# EAGLE board sonar_preprocessor (EAGLE 8.3.2)
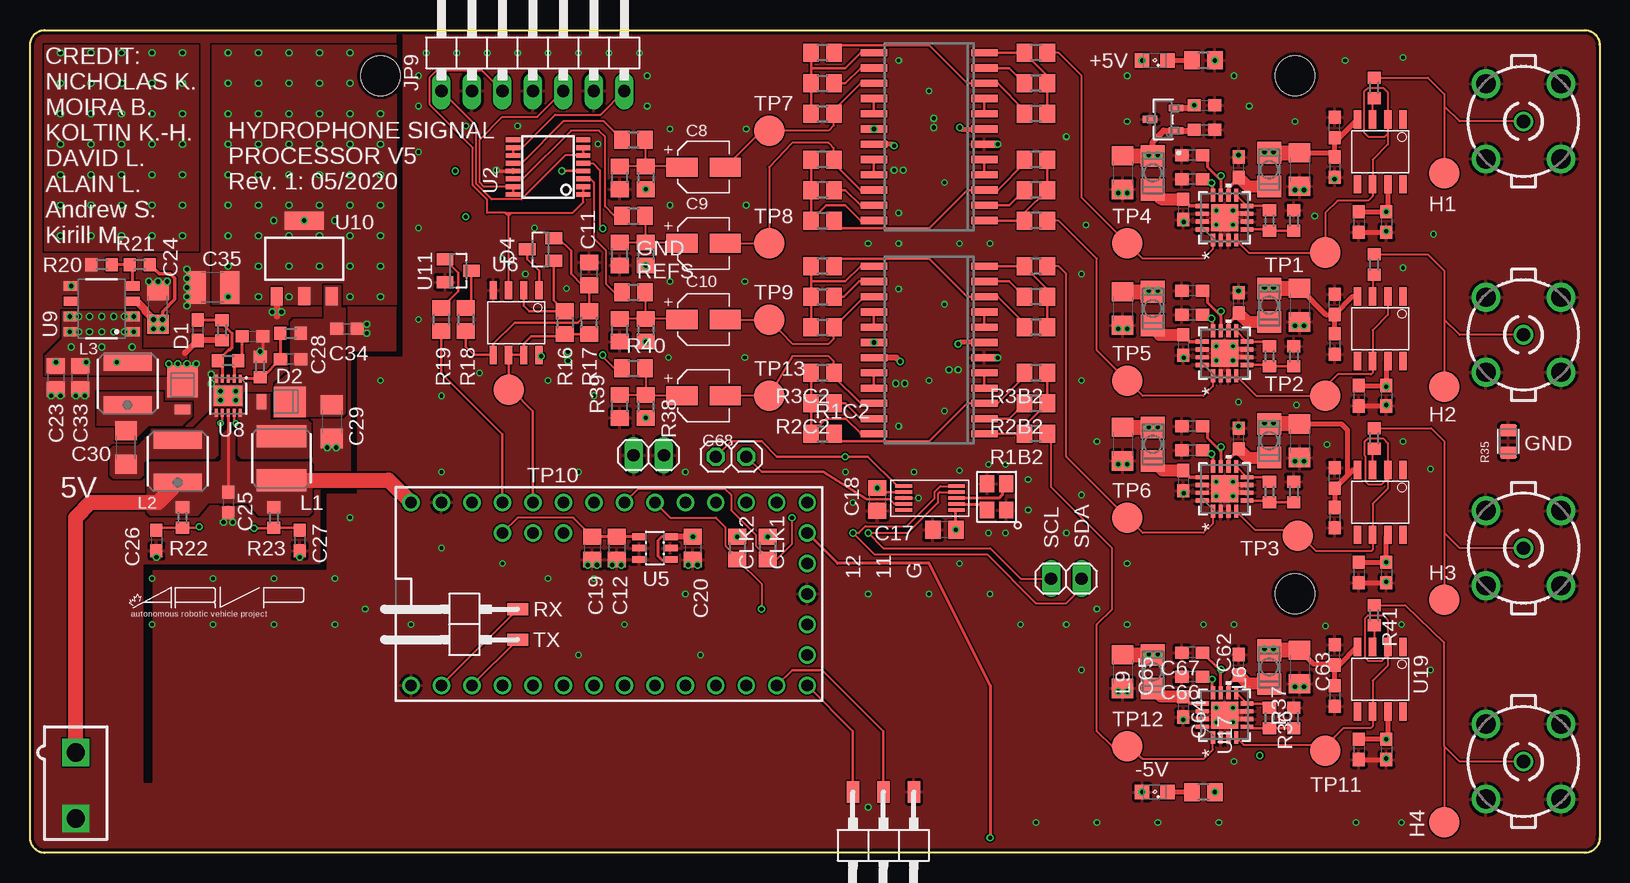
[diagram p7: board, top side]
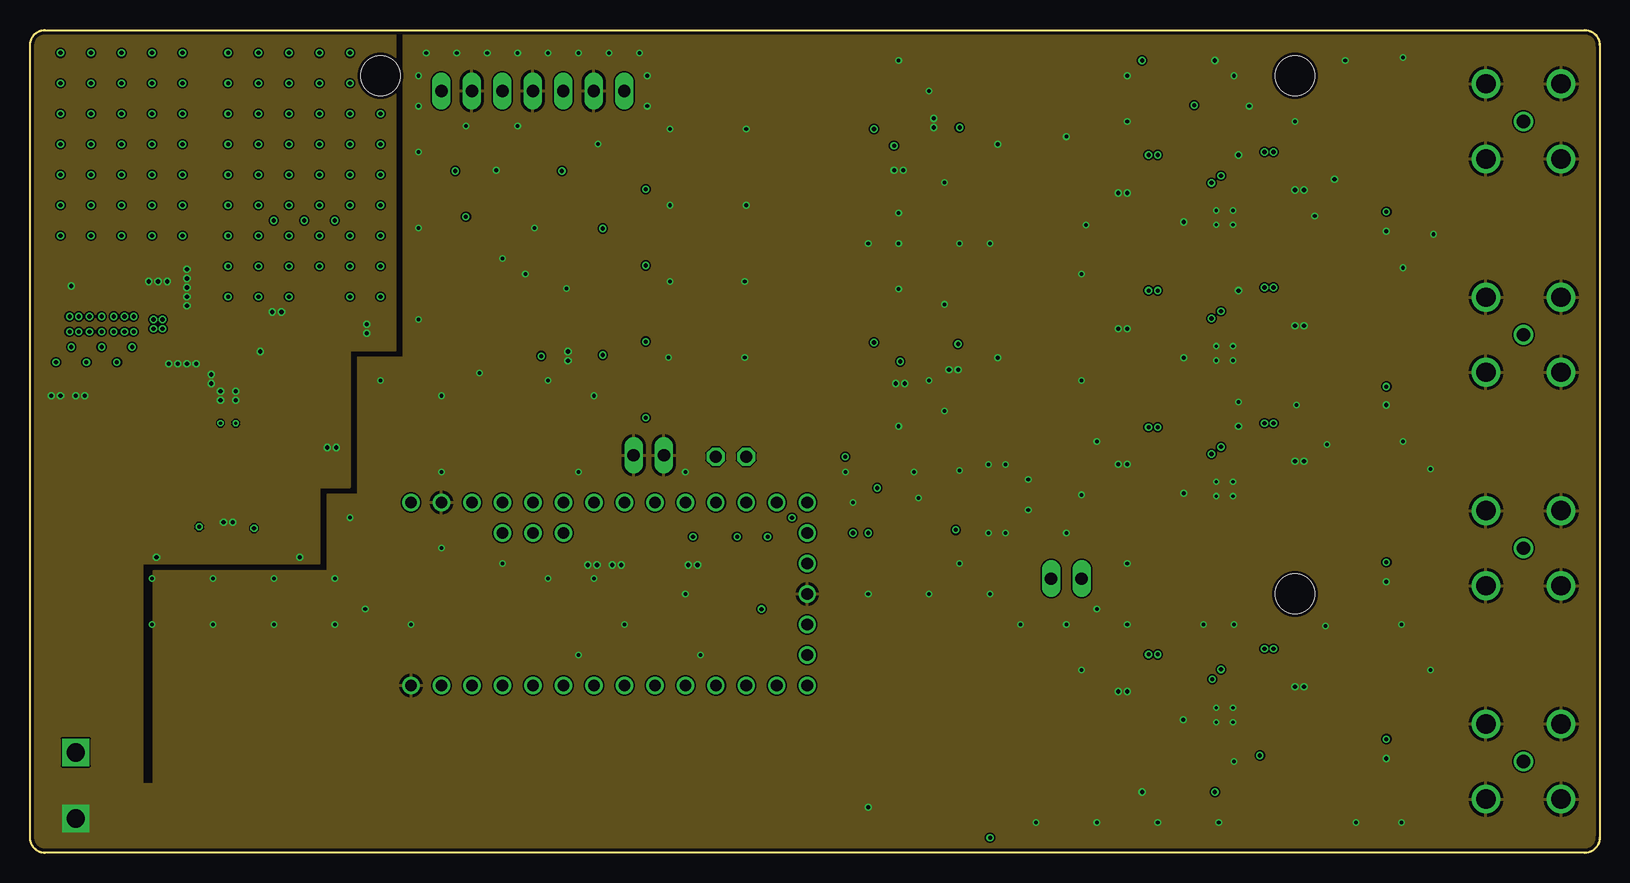
[diagram p8: board, inner layer Route2]
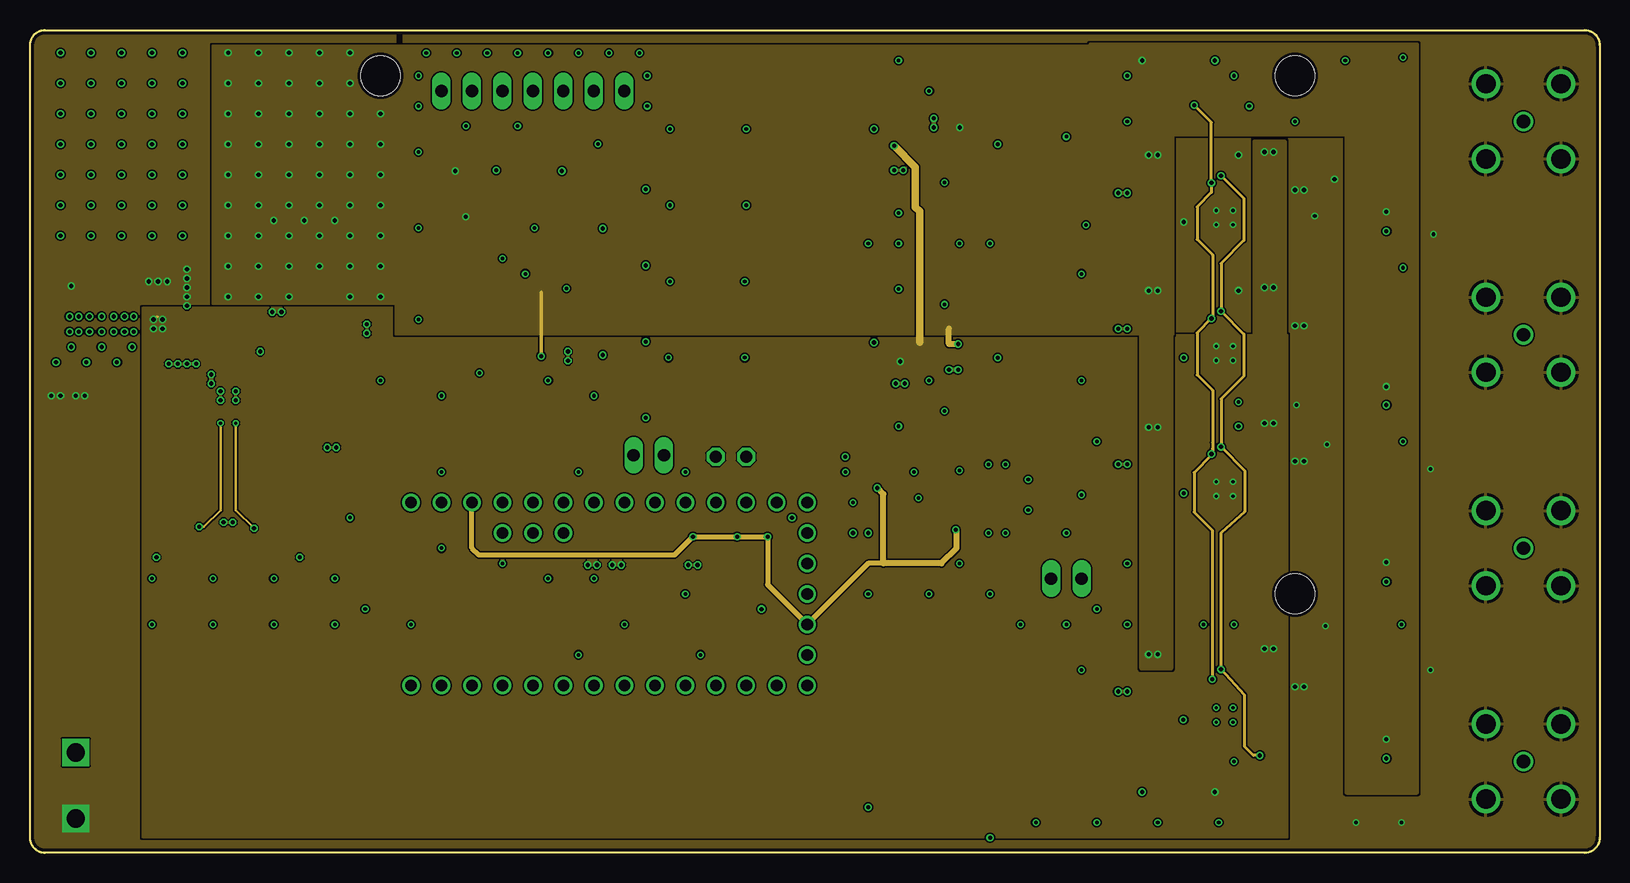
[diagram p9: board, inner layer Route15]
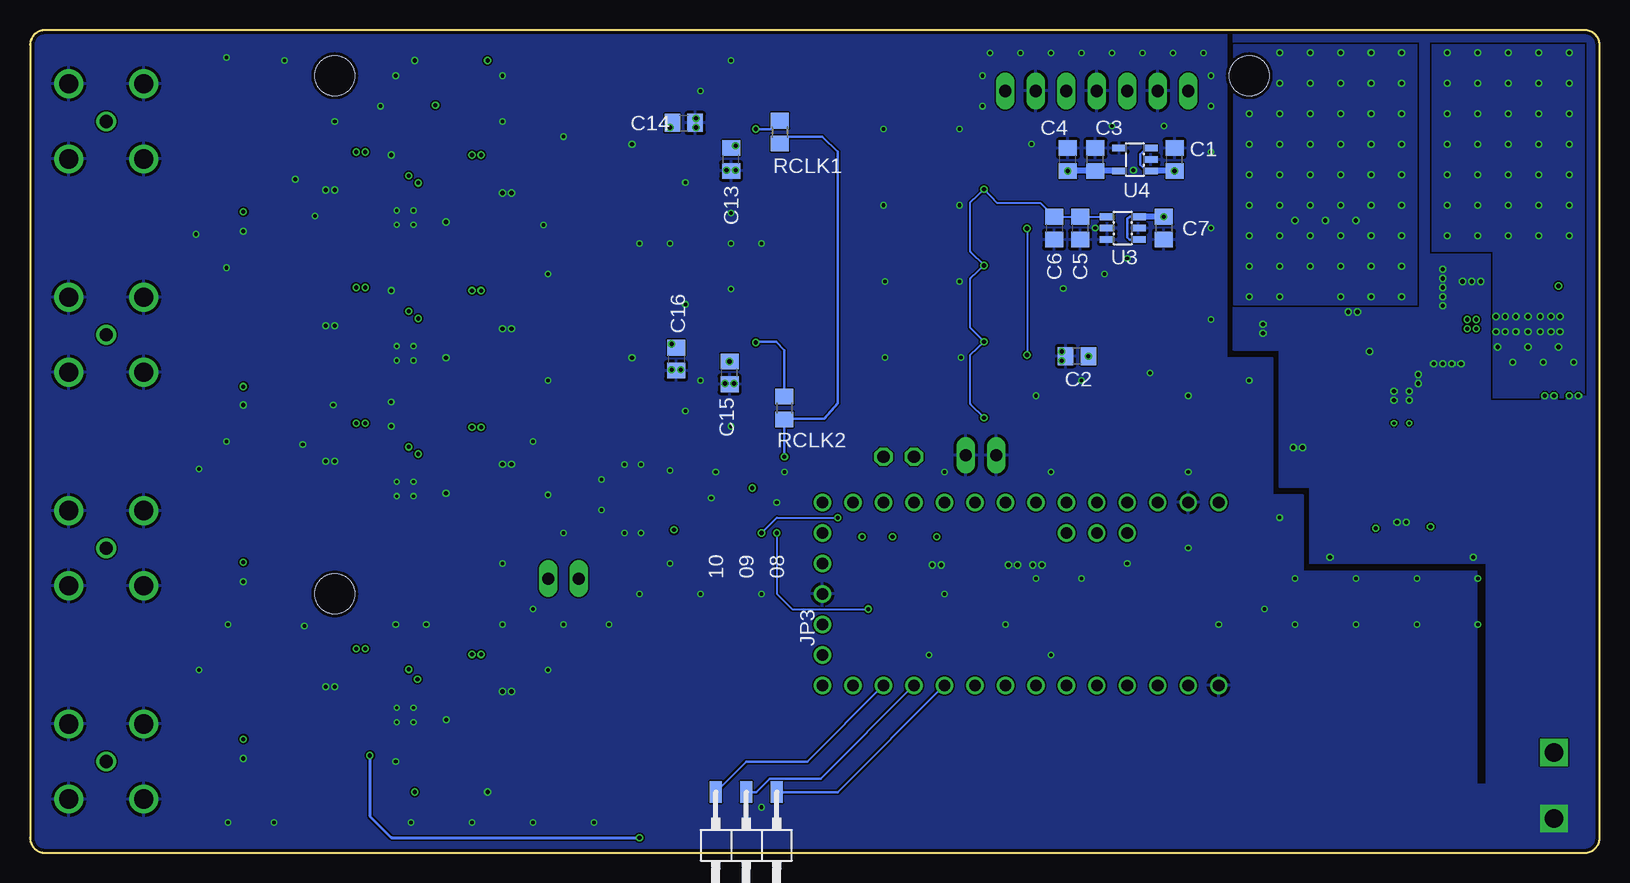
[diagram p10: board, bottom side, seen from below]

Size 130.81 x 68.58 mm. Coordinates in mm from the lower left corner, seen from the top.
Outline: 130.81,67.31 130.81,1.27 arc-90 129.54,0 1.27,0 arc-90 0,1.27 0,67.31 arc-90 1.27,68.58 129.54,68.58 arc-90 130.81,67.31
Copper layers (1*2*15*16): Top 0.035mm / dielectric 0.1702mm / Route2 0.0175mm / dielectric 47mil / Route15 0.0175mm / dielectric 0.1702mm / Bottom 0.035mm
Design rules "OSHPark4Layer": minimum track width 6mil, minimum drill 10mil, track to track 5mil, track to pad 5mil, pad to pad 5mil, via to via 5mil, smd to smd 0mil, copper to edge 10mil, drill to drill 10mil, minimum pad ring 5mil, minimum via ring 5mil, stop-mask expansion 2mil, vias tented up to drill 100mil, thermal gap 10mil
Net classes: 1 net1: clearance 0.203 mm to class 0
Milling: 8 lines

## Footprints (pad centres in the part's own frame; a part is rotated, then mirrored left to right if it is on the bottom)
FA-238 = smd 1.4 x 1.2: P$1 0,-1.6; P$2 2.2,-1.6; P$3 2.2,0; P$4 0,0
C0805 = smd 1.3 x 1.5: 1 -0.95,0; 2 0.95,0
2.6X1.6X1(BXCXA) = smd 2.6 x 1.6: 1 1.8,0; 2 -1.8,0
C0603 = smd 1.1 x 1: 1 -0.85,0; 2 0.85,0
C1206 = smd 1.6 x 1.8: 1 -1.4,0; 2 1.4,0
C1210 = smd 1.6 x 2.7: 1 -1.4,0; 2 1.4,0
5566-2 = drill 1.524 square: 1 0,-2.756; 2 0,2.756
DO-216AA = smd 2.67 x 2.54: P$1 -0.699,0 | smd 0.8 x 1.27: P$2 1.653,0
SOT23 = smd 1 x 1.4: 1 -0.95,-1.1; 2 0.95,-1.1; 3 0,1.1
B2,54 = smd 2.54 x 2.54: TP 0,0
TE_5-1634503-1 = drill 1.1: 1 0,0 | drill 1.6: 2 3.13,3.13; 3 -3.13,3.13; 4 -3.13,-3.13; 5 3.13,-3.13
1X03SMD/90 = smd 1.016 x 1.778: 1 -1.27,-5.08; 2 1.27,-5.08; 3 3.81,-5.08
1X02 = drill 1.016 long: 1 -1.27,0; 2 1.27,0
1X01 = drill 1.016 octagon: 1 0,0
1X02SMD/90 = smd 1.016 x 1.778: 1 -1.27,-5.08; 2 1.27,-5.08
1X07/90 = drill 1.016 long: 1 -7.62,-3.81; 2 -5.08,-3.81; 3 -2.54,-3.81; 4 0,-3.81; 5 2.54,-3.81; 6 5.08,-3.81; 7 7.62,-3.81
NS4.9X4.9 = smd 1.85 x 4.1: P$1 -1.825,0; P$2 1.825,0
NS5X5 = smd 1.5 x 4: P$1 -1.8,0; P$2 1.8,0
L3225P = smd 1.8 x 2: 1 -1.4,0; 2 1.4,0
SML0805 = smd 1.2 x 1.2: A 1.05,0; C -1.05,0
R0805 = smd 1.3 x 1.5: 1 -0.95,0; 2 0.95,0
R0603 = smd 1 x 1.1: 1 -0.85,0; 2 0.85,0
RESC2012X65N = smd 1 x 1.42: 1 -0.935,0; 2 0.935,0
TEENSY_3.1_BASIC = drill 0.965: 0 -7.62,13.97; 1 -7.62,11.43; 2 -7.62,8.89; 3 -7.62,6.35; 3.3V 7.62,11.43; 3.3V1 -2.54,-16.51; 4 -7.62,3.81; 5 -7.62,1.27; 6 -7.62,-1.27; 7 -7.62,-3.81; 8 -7.62,-6.35; 9 -7.62,-8.89; 10 -7.62,-11.43; 11 -7.62,-13.97; 12 -7.62,-16.51; 13 7.62,-16.51; 14/A0 7.62,-13.97; 15/A1 7.62,-11.43; 16/A2 7.62,-8.89; 17/A3 7.62,-6.35; 18/A4 7.62,-3.81; 19/A5 7.62,-1.27; 20/A6 7.62,1.27; 21/A7 7.62,3.81; 22/A8 7.62,6.35; 23/A9 7.62,8.89; A10 5.08,6.35; A11 5.08,3.81; A14 5.08,-16.51; AGND 7.62,13.97; AREF 5.08,8.89; GND -7.62,16.51; GND1 0,-16.51; PGM 2.54,-16.51; VBAT -5.08,-16.51; VIN 7.62,16.51
SSOP16 = smd 0.4 x 1.2: 1 -2.275,-2.925; 2 -1.625,-2.925; 3 -0.975,-2.925; 4 -0.325,-2.925; 5 0.325,-2.925; 6 0.975,-2.925; 7 1.625,-2.925; 8 2.275,-2.925; 9 2.275,2.925; 10 1.625,2.925; 11 0.975,2.925; 12 0.325,2.925; 13 -0.325,2.925; 14 -0.975,2.925; 15 -1.625,2.925; 16 -2.275,2.925
SOT23-6 = smd 0.55 x 1.2: 1 -0.95,-1.3; 2 0,-1.3; 3 0.95,-1.3; 4 0.95,1.3; 5 0,1.3; 6 -0.95,1.3
SOT23-5 = smd 0.55 x 1.2: 1 -0.95,-1.3; 2 0,-1.3; 3 0.95,-1.3; 4 0.95,1.3; 5 -0.95,1.3
SO-8 = smd 1.524 x 0.61: 1 -2.692,1.905; 2 -2.692,0.635; 3 -2.692,-0.635; 4 -2.692,-1.905; 5 2.692,-1.905; 6 2.692,-0.635; 7 2.692,0.635; 8 2.692,1.905
CP_16_4 = smd 2.261 x 2.261: GND1 0,0 | smd 1.067 x 0.356: GNEG 1.865,0.975; GPOS 1.865,0.325; INPP -1.865,-0.975; PWRA -1.865,0.325; VCOM -1.865,-0.325; VGAI 1.865,-0.975; VNEG 1.865,-0.325; VOUT -1.865,0.975 | smd 0.356 x 1.067: INPN -0.975,-1.865; NC 0.325,-1.865; NC1 -0.325,-1.865; NC2 0.325,1.865; NC3 -0.325,1.865; NC4 -0.975,1.865; PRAO 0.975,-1.865; VPOS 0.975,1.865
10-WFDFN = smd 0.675 x 0.25: P$1 -1.413,1; P$2 -1.413,0.5; P$3 -1.413,0; P$4 -1.413,-0.5; P$5 -1.413,-1; P$6 1.413,-1; P$7 1.413,-0.5; P$8 1.413,0; P$9 1.413,0.5; P$10 1.413,1 | smd 1.65 x 2.38: P$11 0,0
8-SOIC = smd 1.143 x 0.762: P$1 -2.603,1.905; P$2 -2.603,0.635; P$3 -2.603,-0.635; P$4 -2.603,-1.905; P$5 2.603,-1.905; P$6 2.603,-0.635; P$7 2.603,0.635; P$8 2.603,1.905
SOT233-3 = smd 0.991 x 1.499: P$1 -2.286,-3.15; P$2 0,-3.15; P$3 2.286,-3.15 | smd 3.277 x 1.499: P$4 0,3.15
P3_064 = smd 0.559 x 1.194: 1 -0.95,-1.079; 2 0.95,-1.079; 3 0,1.079
STAND-OFF = hole 3.302: 0,0
SO24W = smd 0.6 x 2.2: 1 -6.985,-4.6; 2 -5.715,-4.6; 3 -4.445,-4.6; 4 -3.175,-4.6; 5 -1.905,-4.6; 6 -0.635,-4.6; 7 0.635,-4.6; 8 1.905,-4.6; 9 3.175,-4.6; 10 4.445,-4.6; 11 5.715,-4.6; 12 6.985,-4.6; 13 6.985,4.6; 14 5.715,4.6; 15 4.445,4.6; 16 3.175,4.6; 17 1.905,4.6; 18 0.635,4.6; 19 -0.635,4.6; 20 -1.905,4.6; 21 -3.175,4.6; 22 -4.445,4.6; 23 -5.715,4.6; 24 -6.985,4.6
MSOP-10 = smd 1.4 x 0.3: P$1 0,0; P$2 0,-0.5; P$3 0,-1; P$4 0,-1.5; P$5 0,-2; P$6 4.4,-2; P$7 4.4,-1.5; P$8 4.4,-1; P$9 4.4,-0.5; P$10 4.4,0

## Placement (x,y rotation side)
25MHZ1  FA-238  [FA-238]  79.76,28.57 90 top
C1  100n  [C0805]  35.43,57.79 90 bottom
C2  100n  [C0805]  43.56,41.4 180 bottom
C3  100n  [C0805]  42.04,57.79 90 bottom
C4  1u  [C0805]  44.32,57.79 90 bottom
C5  100n  [C0805]  43.31,52.07 270 bottom
C6  1u  [C0805]  45.47,52.07 270 bottom
C7  1u  [C0805]  36.32,52.07 270 bottom
C8  10u  [2.6X1.6X1(BXCXA)]  56.13,57.15 180 top
C9  10u  [2.6X1.6X1(BXCXA)]  56.13,50.8 180 top
C10  10u  [2.6X1.6X1(BXCXA)]  56.13,44.45 180 top
C11  5n  [C0805]  46.61,48.26 90 top
C12  100n  [C0805]  48.89,25.4 270 top
C13  0.1u  [C0805]  72.39,57.79 90 bottom
C14  0.1u  [C0805]  76.33,60.83 0 bottom
C15  0.1u  [C0805]  72.52,40.01 90 bottom
C16  0.1u  [C0805]  76.96,41.15 270 bottom
C17  0.47u  [C0805]  76.2,26.92 180 top
C18  0.47u  [C0805]  70.61,29.46 270 top
C19  1u  [C0805]  46.86,25.4 270 top
C20  1u  [C0805]  55.25,25.4 270 top
C21  0.1uF  [C0603]  100.74,57.14 90 top
C22  10uF  [C1206]  105.8,56.95 270 top
C23  10uF  [C0805]  2.16,39.62 270 top
C24  1uF  [C1206]  10.67,45.47 90 top
C25  10uF  [C0603]  16.51,29.21 270 top
C26  0.33uF  [C0603]  10.54,26.04 270 top
C27  0.33uF  [C0603]  22.48,26.04 270 top
C28  0.33pF  [C0603]  21.72,41.15 180 top
C29  4.7uF  [C1206]  25.15,35.94 270 top
C30  1uF  [C1206]  8,33.78 90 top
C31  0.1uF  [C0603]  18.54,43.05 0 top
C32  68pF  [C0603]  13.97,43.56 270 top
C33  10uF  [C0805]  4.19,39.62 90 top
C34  10uF  [C0603]  26.42,43.69 0 top
C35  100uF  [C1210]  15.24,47.12 180 top
C36  0.1uF  [C0603]  96.1,53.63 270 top
C37  10uF  [C1206]  91.05,56.69 270 top
C38  0.1uF  [C0603]  96.85,56.14 180 top
C39  1nF  [C0603]  96.85,58.16 180 top
C40  0.1uF  [C0603]  100.74,45.84 90 top
C41  10uF  [C1206]  105.8,45.65 270 top
C42  0.1uF  [C0603]  96.1,42.33 270 top
C43  10uF  [C1206]  91.05,45.37 270 top
C44  0.1uF  [C0603]  96.85,44.84 180 top
C45  1nF  [C0603]  96.85,46.86 180 top
C46  0.1uF  [C0603]  100.74,34.54 90 top
C47  10uF  [C1206]  105.8,34.35 270 top
C48  0.1uF  [C0603]  96.1,31.03 270 top
C49  10uF  [C1206]  91.06,34.07 270 top
C50  0.1u  [C0603]  108.71,31.24 90 top
C51  0.1u  [C0603]  108.71,27.94 270 top
C52  0.1u  [C0603]  110.74,23.37 270 top
C53  0.1u  [C0603]  113.03,23.37 270 top
C54  0.1u  [C0603]  108.71,45.72 90 top
C55  0.1u  [C0603]  108.71,42.42 270 top
C56  0.1u  [C0603]  110.74,38.1 270 top
C57  0.1u  [C0603]  113.03,38.1 270 top
C58  0.1u  [C0603]  108.71,60.45 90 top
C59  0.1u  [C0603]  108.71,57.15 270 top
C60  0.1u  [C0603]  110.74,52.58 270 top
C61  0.1u  [C0603]  113.03,52.58 270 top
C62  0.1uF  [C0603]  100.74,15.69 90 top
C63  10uF  [C1206]  105.8,15.49 270 top
C64  0.1uF  [C0603]  96.1,12.17 270 top
C65  10uF  [C1206]  91.06,15.11 270 top
C66  0.1uF  [C0603]  96.85,14.68 180 top
C67  1nF  [C0603]  96.85,16.7 180 top
C68  10u  [2.6X1.6X1(BXCXA)]  56.13,38.1 180 top
C69  0.1u  [C0603]  108.71,16.51 90 top
C70  0.1uF  [C0603]  96.85,33.54 180 top
C71  1nF  [C0603]  96.85,35.56 180 top
C72  0.1uF  [C0603]  97.88,60.26 0 top
C73  0.1uF  [C0603]  97.88,62.31 0 top
C74  0.1u  [C0603]  108.71,13.08 270 top
C75  0.1u  [C0603]  110.74,8.64 270 top
C76  0.1u  [C0603]  113.03,8.64 270 top
CON4  MOLEX_5566-2  [5566-2]  3.81,5.62 180 top
D1  MBRM120  [DO-216AA]  12.7,38.61 270 top
D2  MBRM120  [DO-216AA]  20.95,37.59 180 top
D4  BAT54S  [SOT23]  42.55,50.29 90 top
H1  TPB2,54  [B2,54]  117.86,56.64 90 top
H2  TPB2,54  [B2,54]  117.86,38.86 90 top
H3  TPB2,54  [B2,54]  117.86,21.08 90 top
H4  TPB2,54  [B2,54]  117.86,2.54 90 top
J1  TE_5-1634503-1TE  [TE_5-1634503-1]  124.46,60.96 90 top
J2  TE_5-1634503-1TE  [TE_5-1634503-1]  124.46,43.18 90 top
J3  TE_5-1634503-1TE  [TE_5-1634503-1]  124.46,25.4 270 top
J4  TE_5-1634503-1TE  [TE_5-1634503-1]  124.46,7.62 90 top
JP2  JP2  [1X03SMD/90]  72.39,0 180 top
JP3  JP3  [1X03SMD/90]  69.85,0 180 bottom
JP4  JP4  [1X02]  51.56,33.15 180 top
JP5  JP5  [1X01]  59.69,33.02 0 top
JP6  JP6  [1X01]  57.15,33.02 0 top
JP7  JP7  [1X02]  86.36,22.86 180 top
JP8  JP8  [1X02SMD/90]  35.56,19.05 90 top
JP9  [1X07/90]  41.91,67.31 0 top
L1  2.2uH  [NS4.9X4.9]  20.95,32.89 90 top
L2  10uH  [NS5X5]  12.32,32.64 90 top
L3  15uH  [NS5X5]  8.13,39.12 90 top
L4  120nH  [L3225P]  103.27,56.95 90 top
L5  120nH  [L3225P]  93.58,56.67 90 top
L6  120nH  [L3225P]  103.27,15.49 90 top
L7  120nH  [L3225P]  103.27,45.65 90 top
L8  120nH  [L3225P]  93.58,45.37 90 top
L9  120nH  [L3225P]  93.58,15.11 90 top
L11  120nH  [L3225P]  103.27,34.35 90 top
L12  120nH  [L3225P]  93.58,34.07 90 top
LED1  LED1  [SML0805]  93.73,66.04 180 top
LED2  LED2  [SML0805]  93.73,5.08 180 top
R1  25k  [R0805]  51.31,56.26 270 top
R1A1  350k  [R0805]  83.82,66.68 180 top
R1A2  350k  [R0805]  83.82,48.9 180 top
R1B1  350k  [R0805]  83.82,52.7 180 top
R1B2  350k  [R0805]  83.82,34.93 180 top
R1C1  350k  [R0805]  66.04,52.7 0 top
R1C2  350k  [R0805]  66.04,34.93 0 top
R1D1  350k  [R0805]  66.04,66.68 180 top
R1D2  350k  [R0805]  66.04,48.9 180 top
R2  25k  [R0805]  49.15,56.26 90 top
R2A1  10k  [R0805]  83.82,64.13 180 top
R2A2  10k  [R0805]  83.82,46.35 180 top
R2B1  10k  [R0805]  83.82,55.24 180 top
R2B2  10k  [R0805]  83.82,37.46 180 top
R2C1  10k  [R0805]  66.04,55.24 180 top
R2C2  10k  [R0805]  66.04,37.46 180 top
R2D1  10k  [R0805]  66.04,64.13 0 top
R2D2  10k  [R0805]  66.04,46.35 0 top
R3  10k  [R0805]  58.93,25.4 270 top
R3A1  350k  [R0805]  83.82,61.59 180 top
R3A2  350k  [R0805]  83.82,43.82 180 top
R3B1  350k  [R0805]  83.82,57.79 180 top
R3B2  350k  [R0805]  83.82,40.01 180 top
R3C1  350k  [R0805]  66.04,57.79 180 top
R3C2  350k  [R0805]  66.04,40.01 180 top
R3D1  350k  [R0805]  66.04,61.59 0 top
R3D2  350k  [R0805]  66.04,43.82 0 top
R4  10k  [R0805]  61.47,25.4 270 top
R5  25k  [R0805]  50.29,59.44 0 top
R6  25k  [R0805]  51.31,49.91 270 top
R7  25k  [R0805]  49.15,49.91 90 top
R8  25k  [R0805]  50.29,53.09 0 top
R9  25k  [R0805]  51.31,43.56 270 top
R10  25k  [R0805]  49.15,43.56 90 top
R11  25k  [R0805]  50.29,46.74 0 top
R12  1.9k  [R0603]  103.3,52.7 270 top
R13  100  [R0603]  105.32,52.7 90 top
R14  1.9k  [R0603]  103.3,41.4 270 top
R15  100  [R0603]  105.32,41.4 90 top
R16  10K  [R0805]  44.58,44.2 270 top
R17  50K  [R0805]  46.61,44.2 90 top
R18  1K  [R0805]  36.32,44.45 270 top
R19  10K  [R0805]  34.29,44.45 90 top
R20  150kOhm  [R0603]  5.97,49.02 0 top
R21  47.5kOhm  [R0603]  9.14,49.02 0 top
R22  4.7kOhm  [R0603]  12.7,27.94 90 top
R23  4.7kOhm  [R0603]  20.32,27.94 90 top
R24  90.9kOhm  [R0603]  21.72,43.31 0 top
R25  15kOhm  [R0603]  19.18,40.51 270 top
R26  105kOhm  [R0603]  16,43.56 90 top
R27  15kOhm  [R0603]  16.51,41.02 0 top
R28  1.9k  [R0603]  103.3,30.1 270 top
R29  100  [R0603]  105.32,30.1 90 top
R30  580  [R0805]  97.79,66.04 180 top
R31  580  [R0805]  97.79,5.08 180 top
R32  0  [R0603]  112.01,34.54 270 top
R33  0  [R0603]  112.01,49.02 270 top
R34  0  [R0603]  112.01,63.75 270 top
R35  RCT-0C  [RESC2012X65N]  123.19,34.29 90 top
R36  1.9k  [R0603]  103.3,11.24 270 top
R37  100  [R0603]  105.32,11.24 90 top
R38  25k  [R0805]  51.31,37.21 270 top
R39  25k  [R0805]  49.15,37.21 90 top
R40  25k  [R0805]  50.29,40.39 0 top
R41  0  [R0603]  112.01,19.81 270 top
RCLK1  200  [R0805]  68.33,60.07 270 bottom
RCLK2  200  [R0805]  67.95,37.08 270 bottom
TP1  TPB2,54  [B2,54]  107.95,50.04 0 top
TP2  TPB2,54  [B2,54]  107.95,38.1 0 top
TP3  TPB2,54  [B2,54]  105.66,26.42 0 top
TP4  TPB2,54  [B2,54]  91.44,50.8 0 top
TP5  TPB2,54  [B2,54]  91.44,39.37 0 top
TP6  TPB2,54  [B2,54]  91.44,27.94 0 top
TP7  TPB2,54  [B2,54]  61.6,60.2 0 top
TP8  TPB2,54  [B2,54]  61.6,50.8 0 top
TP9  TPB2,54  [B2,54]  61.6,44.45 0 top
TP10  TPB2,54  [B2,54]  39.88,38.61 0 top
TP11  TPB2,54  [B2,54]  107.95,8.51 0 top
TP12  TPB2,54  [B2,54]  91.44,8.89 0 top
TP13  TPB2,54  [B2,54]  61.6,38.1 0 top
U1  TEENSY_3.1_BASIC  [TEENSY_3.1_BASIC]  48.26,21.59 90 top
U2  LTC6242  [SSOP16]  43.18,57.15 90 top
U3  MCP1501  [SOT23-6]  39.75,52.07 270 bottom
U4  AP7331-20WG-7SOT-5  [SOT23-5]  38.73,57.79 90 bottom
U5  MCP1501  [SOT23-6]  52.07,25.4 270 top
U6  LTC6241  [SO-8]  40.51,44.2 270 top
U7  AD8336ACPZ-R7  [CP_16_4]  99.55,52.94 90 top
U8  LT3471'  [10-WFDFN]  16.51,38.1 270 top
U9  LT1175  [8-SOIC]  5.97,45.34 180 top
U10  LT1117-5  [SOT233-3]  22.86,49.53 0 top
U11  MMBT3904  [SOT23]  35.69,48.51 270 top
U12  AD8336ACPZ-R7  [CP_16_4]  99.55,41.64 90 top
U13  AD8336ACPZ-R7  [CP_16_4]  99.55,30.34 90 top
U14  U14  [SO-8]  112.52,29.21 270 top
U15  U15  [SO-8]  112.52,43.69 270 top
U16  U16  [SO-8]  112.52,58.42 270 top
U17  AD8336ACPZ-R7  [CP_16_4]  99.55,11.48 90 top
U18  ISL21080DIH309Z-TK  [P3_064]  94.42,61.13 90 top
U19  U14  [SO-8]  112.52,14.48 270 top
U$1  [A4L-LOC]  -68.58,-46.99 0 top  (outside the outline)
U$2  [STAND-OFF]  105.41,21.59 0 top
U$3  [STAND-OFF]  105.41,64.77 0 top
U$4  [ARVP]  8.38,19.68 0 top
U$5  [STAND-OFF]  29.21,64.77 0 top
U$6  LTC1264SMD  [SO24W]  74.93,59.69 90 top
U$7  LTC1264SMD  [SO24W]  74.93,41.91 90 top
U$8  SI5351A  [MSOP-10]  77.22,28.57 180 top

## Tracks (layer width: path | path; a pad name or v marks a point on that pad's centre or on a via)
2V5_REF
  Top 0.152: C19.1 45.27,27.94 40.64,27.94 U1.AREF
  Top 0.254: U5.1 C12.1 C19.1
2V_REF  (via drill 0.35)
  Bottom 0.152: 51.25,48.96 R6.2 | R6.2 52.45,50.1 52.45,54.23 R1.2 50.24,54.18 46.99,54.18 | R6.2 52.45,47.88 52.45,43.75 R9.2 52.45,41.53 52.45,37.4 R38.2 | 46.99,54.18 46.89,54.18 | 46.99,54.18 46.62,54.18 C6.1 C5.1 U3.1
  other vias: 51.31,48.96 51.31,42.61 51.31,55.31 51.31,36.26
7.5V
  pour Top (no thermals): 20.45,36.45 26.03,36.45 26.29,36.7 26.29,45.34 25.91,45.34 25.91,47.24 24.51,47.24 24.51,44.45 21.97,44.45 21.72,44.2 21.72,40.13 21.34,39.75 20.45,38.99
+2V  (via drill 0.35)
  Top 0.203: C4.1 46.09,56.84 U2.4
  Bottom 0.508: C4.1 C3.1 U4.5
  other vias: 44.32,56.84
+3V3  (via drill 0.35)
  Top 0.203: U$8.P$7 70.95,30.07
  Top 0.254: 70.95,30.07 C18.1 | C17.1 77.15,28.51 U$8.P$1 | U5.6 52.64,26.35 52.32,26.04 52.32,24.76 52.64,24.45 U5.4
  Top 0.508: C20.1 U5.6
  Route15 0.406: U1.3.3V 36.83,25.4 37.4,24.83 53.73,24.83 C20.1 R3.1 R4.1 61.47,22.35 U1.3.3V1 69.85,24.13 71.12,24.13
  Route15 0.508: C18.1 71.12,29.91 71.12,24.13 75.95,24.13 77.22,25.4 77.22,26.86 C17.1
  other vias: 61.47,26.35 58.93,26.35 70.61,30.41 77.15,26.92 55.25,26.35
+5V  (via drill 0.35)
  Top 0.152: L12.2 v93.22,35.47 | L8.2 93.22,47.13 v93.22,46.86 | L5.2 93.58,57.89 v93.22,58.17 | L9.2 93.25,16.51 v93.22,16.55
  Top 0.203: U6.8 42.52,41.4 C2.1
  Top 0.406: v77.47,60.45 77.6,60.32 U$6.7 | U$7.7 77.47,42.54 v77.34,42.42 | C60.1 C61.1 113.16,53.55 U16.7 | C56.1 112.94,38.95 v113.03,38.86 C57.1 113.03,40.87 U15.7 | C52.1 C53.1 113.03,26.39 U14.7 | C75.1 C76.1 113.16,9.61 U19.7
  Top 0.508: C72.1 96.83,60.18 U18.1 94.48,60.18 93.58,59.29 L5.2
  Top 1.27: C49.1 v93.22,35.47 | C43.1 93.83,46.77 L8.2 | C37.1 93.81,58.09 L5.2 | C65.1 L9.2
  Route15 0.305: 42.61,46.73 C2.1
  Route15 0.508: v77.34,42.42 76.58,42.42 76.58,43.69
  Bottom 0.203: U4.1 37.78,56.84 38.29,57.34 38.29,58.23 37.78,58.73 U4.3 | U3.6 39.18,53.02 39.37,52.83 39.37,51.31 39.18,51.12 U3.4
  Bottom 0.406: C16.1 77.02,42.1 v77.34,42.42 | C14.1 77.28,60.65 v77.47,60.45
  Bottom 0.508: C1.1 U4.1 | C7.1 U3.6
  other vias: 26.67,59.05 24.13,56.51 21.59,56.51 19.05,56.51 16.51,56.51 16.51,53.98 19.05,53.98 21.59,53.98 24.13,53.98 26.67,53.98 16.51,51.43 19.05,51.43 21.59,51.43 24.13,51.43 26.67,51.43 16.51,48.9 19.05,48.9 21.59,48.9 24.13,48.9 26.67,48.9 26.67,56.51 24.13,59.05 21.59,59.05 19.05,59.05 16.51,59.05 26.67,61.59 24.13,61.59 21.59,61.59 19.05,61.59 16.51,61.59 24.13,66.68 21.59,66.68 19.05,66.68 16.51,66.68 24.13,64.13 21.59,64.13 19.05,64.13 16.51,64.13 16.51,46.35 19.05,46.35 26.67,46.35 26.67,64.13 26.67,66.68 29.21,61.59 29.21,59.05 29.21,56.51 21.59,46.35 29.21,53.98 29.21,51.43 29.21,48.9 29.21,46.35 22.86,52.7 20.32,52.7 25.4,52.7 35.43,56.84 36.32,53.02 42.61,41.4 93.98,35.47 93.98,46.86 93.98,58.17 92.68,66.04 113.03,53.43 113.03,24.22 113.03,9.49 93.98,16.55
  pour Top (rank 2, no thermals): 30.48,67.31 30.48,45.72 15.24,45.72 15.24,67.31
  pour Bottom (rank 2, no thermals): 30.48,67.31 30.48,45.72 15.24,45.72 15.24,67.31
  pour Route15: 15.24,67.31 95.25,67.31 95.25,43.18 30.48,43.18 30.48,45.72 15.24,45.72
  pour Route15 (no thermals): 92.65,59.44 95.05,59.44 95.05,15.39 92.65,15.39
  pour Route15: 88.39,67.31 88.39,59.94 109.73,59.94 109.73,5.08 115.57,5.08 115.57,67.31
-5V  (via drill 0.35)
  Top 0.152: L4.2 103.27,58.15 v103.63,58.42 | v102.87,35.81 102.95,36.07 L11.2 103.57,35.75 v103.63,35.81 | L7.2 102.95,47.37 v102.87,47.12 | 109.11,59.6 C58.1 | v102.87,17.02 102.99,16.89 L6.2 103.51,16.89 v103.63,17.02
  Top 0.305: R21.2 10.76,48.26 11.69,48.26 12.06,47.89 12.06,46.13 11.05,45.12 v11.05,44.45 | C24.1 v11.05,43.68 | 108.5,58.21 C59.1
  Top 0.406: v72.01,58.93 71.88,59.05 U$6.19 | U16.4 109.11,59.6 | C22.1 108.5,58.35 108.5,58.21 | C59.1 C58.1 | C41.1 107.98,44.87 C54.1 | C54.1 110.22,46.38 U15.4 | C55.1 C54.1 | C51.1 C50.1 109.77,31.45 | 109.77,31.45 110.22,31.9 U14.4 | C47.1 109.28,35.75 109.77,35.26 109.77,31.45 | C63.1 106.95,15.75 108.62,15.75 C69.1 | C69.1 109.11,15.66 U19.4 | C74.1 C69.1
  Top 0.508: v72.52,40.95 72.2,41.27 U$7.19
  Top 0.61: C24.1 9.6,45.13 9.6,45.27 8.9,45.97 U9.P$3
  Top 1.27: L7.2 C41.1 | L4.2 C22.1 | C47.1 L11.2 | C63.1 L6.2
  Route15 0.152: 10.54,44.7 10.67,44.7
  Route15 0.61: v72.01,58.93 73.79,57.15 73.79,53.82 74.14,53.46 74.14,42.57
  Bottom 0.406: C13.2 72.33,58.61 v72.01,58.93
  other vias: 10.29,43.68 10.29,44.45 102.87,58.42 103.63,47.12 98.74,5.08
  pour Route15 (rank 2): 9.4,1.27 9.4,45.47 30.48,45.47 30.48,43.18 104.77,43.18 104.77,1.27
  pour Route15 (no thermals): 102.05,15.69 104.55,15.69 104.55,59.24 102.05,59.24
-7.5V  (via drill 0.35)
  Top 0.508: R26.1 C32.2 12.92,41.66
  other vias: 12.7,53.98 10.16,53.98 7.62,53.98 5.08,53.98 2.54,53.98 2.54,51.43 5.08,51.43 7.62,51.43 10.16,51.43 12.7,51.43 12.7,56.51 10.16,56.51 7.62,56.51 5.08,56.51 2.54,56.51 12.7,59.05 10.16,59.05 7.62,59.05 5.08,59.05 2.54,59.05 7.87,43.43 7.87,44.7 4.06,44.7 4.06,43.43 8.64,43.43 8.64,44.7 3.3,44.7 3.3,43.43 6.98,43.43 6.98,44.7 5.97,44.7 5.97,43.43 4.95,43.43 4.95,44.7 12.7,61.59 10.16,61.59 7.62,61.59 5.08,61.59 2.54,61.59 12.7,64.13 10.16,64.13 7.62,64.13 5.08,64.13 2.54,64.13 5.97,42.16 4.7,40.89 3.43,42.16 2.16,40.89 7.24,40.89 8.51,42.16 12.7,66.68 10.16,66.68 7.62,66.68 5.08,66.68 2.54,66.68
  pour Top (no thermals): 1.27,41.4 1.27,39.88 13.08,39.88 13.08,41.91 9.27,41.91 9.27,45.09 2.67,45.09 2.67,42.8
  pour Bottom (rank 2, no thermals): 13.97,67.31 13.97,50.16 8.89,50.16 8.89,39.88 1.27,39.88 1.27,67.31
  pour Top (rank 2, no thermals): 13.97,67.31 13.97,50.16 1.27,50.16 1.27,67.31
  pour Bottom (rank 2, no thermals): 13.97,67.31 13.97,50.16 8.89,50.16 8.89,37.97 1.27,37.97 1.27,67.31
AMP_1
  Top 0.152: R1A1.1 85.73,66.68 87.63,64.77 87.63,54.61 TP4.TP 92.71,49.53 97.79,49.53 98.58,50.32 U7.VOUT
AMP_2
  Top 0.152: R1B1.1 85.73,52.7 88.9,49.53 88.9,41.91 TP5.TP 92.71,38.1 97.79,38.1 98.58,38.88 U12.VOUT
AMP_3
  Top 0.152: R1A2.1 85.73,48.9 86.36,48.26 86.36,33.02 TP6.TP 92.71,26.67 97.79,26.67 98.58,27.45 U13.VOUT
AMP_4
  Top 0.152: R1B2.1 85.09,34.6 85.09,30.48 90.17,25.4 90.17,20.32 88.9,19.05 88.9,10.16 90.17,8.89 TP12.TP 92.71,7.82 97.79,7.82 98.58,8.61 U17.VOUT
BIASED_0
  Top 0.152: R1.1 R2.2 | C8.1 54.27,57.21 R1.1 | R1.1 51.31,59.37 R5.2
BIASED_1
  Top 0.152: R6.1 R7.2 | C9.1 54.27,50.86 R6.1 | R6.1 51.31,53.02 R8.2
BIASED_2
  Top 0.152: R9.1 R10.2 | C10.1 54.27,44.51 R9.1 | R9.1 51.31,46.67 R11.2
BIASED_3
  Top 0.152: R38.1 51.31,40.32 R40.2 | C68.1 51.37,38.1 R38.1 | R38.1 R39.2
CLAMP_IN_0
  Top 0.152: R5.1 47.83,60.96 44.45,60.96 40.97,57.48 U2.12
CLAMP_IN_1
  Top 0.152: U2.14 41.06,56.18 45.09,60.2 47.4,60.2 47.93,59.69 47.93,53.87 48.69,53.09 R8.1
CLAMP_IN_2
  Top 0.152: U2.3 46.7,56.18 46.99,55.88 46.99,51.21 47.98,50.22 47.98,47.45 48.69,46.74 R11.1
CLAMP_IN_3  (via drill 0.35)
  Top 0.152: U2.5 46.92,57.48 47.5,56.9 47.5,52.27 v47.73,52.04 | v47.73,41.5 47.73,41.35 48.69,40.39 R40.1
  Bottom 0.152: v47.73,52.04 v47.73,41.5
CLK1
  Top 0.203: JP5.1 60.96,31.75 66.12,31.75 69.72,29.46 71.63,29.46 72.01,29.08 72.81,29.08 U$8.P$9
CLK2  (via drill 0.35)
  Top 0.203: JP6.1 58.42,34.29 60.96,34.29 62.23,33.02 v67.95,33.02 69.8,33.02 72.26,30.61 72.3,30.57 U$8.P$6
  Bottom 0.203: RCLK1.2 68.13,59.12 67.56,59.69 64.77,59.69 63.5,58.42 63.5,37.46 64.62,36.2 67.88,36.2 RCLK2.2 v67.95,33.02
FILTER_OUT_1
  Top 0.152: R3D1.2 66.99,60.64 66.55,60.2 TP7.TP 60.98,60.2 C8.2
  Top 0.203: U$6.15 69.21,64.13 66.99,61.91 R3D1.2
FILTER_OUT_2
  Top 0.152: C9.2 TP8.TP 61.6,57.15 63.5,59.18 66.55,59.18 66.99,58.74 R3C1.1
  Top 0.203: U$6.22 69.21,55.24 66.99,57.47 R3C1.1
FILTER_OUT_3
  Top 0.152: C10.2 TP9.TP 63.52,42.42 66.55,42.42 66.99,42.86 R3D2.2
  Top 0.203: R3D2.2 69.53,46.35 U$7.15
FILTER_OUT_4
  Top 0.152: R3C2.1 66.99,40.96 66.55,41.4 63.5,41.4 TP13.TP C68.2
  Top 0.203: U$7.22 69.21,37.46 66.99,39.69 R3C2.1
GAIN_NEG  (via drill 0.35)
  Top 0.254: U13.GNEG 98.58,33.12 v98.45,33.24 98.15,33.54 C70.1 | U12.GNEG 98.58,44.41 v98.45,44.54 98.15,44.84 C44.1 | U7.GNEG 98.58,55.71 v98.45,55.84 98.15,56.14 C38.1 | U17.GNEG 98.53,13.4 v98.53,14.48 97.91,14.48 C66.1
  Top 0.508: U18.2 96.68,62.09 C73.1
  Route15 0.254: C73.1 98.45,60.88 v98.45,55.84 98.45,55.04 97.25,53.84 97.25,51.14 98.55,49.84 98.55,44.64 v98.45,44.54 97.25,43.34 97.25,39.84 98.55,38.54 98.55,34.2 98.54,34.19 98.54,33.69 98.55,33.68 98.55,33.34 v98.45,33.24 98.45,33.15 97,31.7 97,28.4 98.53,26.87 v98.53,14.48
  other vias: 97.03,62.31
GAIN_POS  (via drill 0.35)
  Top 0.254: 99.23,56.07 U7.GPOS | C39.1 98.15,58.12 98.15,57.14 99.23,56.07 | 99.23,44.76 U12.GPOS | C45.1 98.15,46.82 98.15,45.84 99.23,44.76 | 99.23,33.46 U13.GPOS | C71.1 98.15,35.52 98.15,34.54 99.23,33.46 | 99.23,33.82 99.23,33.46 | 99.23,45.12 99.23,44.76 | 99.23,56.41 99.23,56.07 | v80.01,1.27 80.01,13.97 74.93,24.13 67.31,24.13 U1.A14 | U17.GPOS 99.23,15.27 v99.25,15.3 99.11,15.3 C67.1
  Top 0.406: v99.25,33.84 99.23,33.82 | v99.25,45.14 99.23,45.12 | v99.25,56.44 99.23,56.41
  Route15 0.254: v99.25,56.44 101.15,54.54 101.15,51.04 99.25,49.14 v99.25,45.14 101.15,43.24 101.15,39.74 99.25,37.84 v99.25,33.84 101.22,31.87 101.22,28.45 99.25,26.67 v99.25,15.3 101.22,13.15 101.22,8.86 101.96,8.13 v102.49,8.13
  Bottom 0.254: v102.49,8.13 102.49,3.07 100.69,1.27 v80.01,1.27
GND  (via drill 0.26, 0.3, 0.35)
  Top 0.152: 99.88,53.26 U7.GND1 | 99.88,41.32 U12.GND1 99.88,41.96 | 99.88,30.01 99.65,30.24 | 99.65,30.24 U13.GND1 | 99.88,30.66 99.6,30.39 | 99.6,30.39 U13.GND1 | 99.88,30.12 99.6,30.39 | 98.77,29.37 99.65,30.24 | 99.23,30.01 99.5,30.29 | 99.13,30.66 99.5,30.29 | 99.5,30.29 U13.GND1 | 99.88,11.14 99.65,11.37 | 99.55,11.27 98.77,10.49 | 99.55,11.27 99.65,11.37 | U17.GND1 99.57,11.48 99.88,11.79 | U17.GND1 99.55,11.27 | U17.GND1 99.46,11.48 v98.85,12.09 | U17.GND1 99.55,11.47 99.65,11.37
  Top 0.254: C31.2 19.39,41.58 R25.1 v19.18,41.78
  Top 0.305: U2.13 38.93,56.82 v38.86,56.9
  Top 0.406: U7.NC 99.88,53.26 | U12.NC1 99.88,41.32 | U12.NC 99.88,41.96 | U13.NC1 99.88,30.01 | U13.NC 99.88,30.66 | C60.2 C61.2 | C56.2 C57.2 | C52.2 C53.2 | C75.2 C76.2 | 99.88,11.79 101.42,11.79 | U17.NC1 99.89,11.16 99.88,11.14
  Top 0.508: U10.P$1 20.57,44.7
  other vias: 3.81,38.1 16.89,27.56 2.54,38.1 1.78,38.1 25.53,33.78 12.32,40.77 17.14,37.72 15.88,37.72 13.84,40.77 11.56,40.77 20.95,45.09 13.08,47.12 13.08,46.35 28.07,43.31 17.14,38.48 15.88,38.48 16.13,27.56 24.77,33.78 28.07,44.07 20.19,45.09 4.57,38.1 13.08,40.77 13.08,47.88 15.11,39.12 10.67,47.62 9.91,47.62 11.43,47.62 15.11,39.88 3.43,47.24 22.48,24.64 10.54,24.64 75.31,60.45 76.58,40.26 13.08,48.64 13.08,45.59 72.14,39.12 80.64,41.27 80.64,59.05 72.01,56.9 44.83,41.78 44.83,41.02 46.48,24 47.24,24 48.51,24 49.28,24 54.86,24 55.63,24 72.77,56.9 75.31,61.21 72.9,39.12 77.34,40.26 100.33,64.77 101.6,62.23 97.79,19.05 87.63,29.84 87.63,39.37 87.63,48.26 80.01,50.8 69.85,50.8 77.47,50.8 72.39,50.8 86.36,59.69 91.44,60.96 91.44,64.77 87.63,15.24 74.93,21.59 88.9,20.32 86.36,19.05 86.36,26.67 88.01,52.32 105.41,60.96 88.9,34.29 80.01,21.59 59.69,60.32 59.69,53.98 59.56,41.27 59.56,47.62 48.26,66.68 53.34,53.98 53.21,41.27 53.34,47.62 54.61,31.75 67.95,31.75 50.8,66.68 32.39,64.77 32.39,58.42 32.39,52.07 42.04,52.07 39.37,49.53 41.28,48.26 44.7,47.04 47.35,59.08 51.44,62.23 40.64,60.58 36.32,60.58 35.56,66.68 38.1,66.68 40.64,66.68 43.18,66.68 45.72,66.68 33.02,66.68 74.04,29.59 98.85,52.34 98.85,53.54 100.25,53.54 100.25,52.34 98.85,41.04 98.85,42.24 100.25,42.24 100.25,41.04 98.85,29.74 98.85,30.94 100.25,30.94 100.25,29.74 90.68,54.99 91.44,54.99 90.68,43.69 91.44,43.69 90.68,32.38 91.44,32.38 105.41,55.24 106.17,55.24 105.41,43.94 106.17,43.94 105.41,32.64 106.17,32.64 100.71,58.17 96.14,52.58 100.71,46.86 96.14,41.27 100.71,35.56 96.14,29.97 32.39,44.45 29.21,39.37 26.67,27.94 34.29,38.1 46.99,38.1 43.18,39.37 45.72,31.75 76.2,36.83 72.39,46.99 76.2,45.72 74.93,39.37 76.2,55.88 72.39,66.04 74.93,63.5 72.39,53.34 82.55,19.05 72.39,35.56 27.94,20.32 10.16,19.05 15.24,19.05 20.32,19.05 25.4,19.05 10.16,22.86 15.24,22.86 20.32,22.86 25.4,22.86 32.39,62.23 51.44,64.77 83.18,31.12 83.18,28.57 81.28,26.67 79.88,26.67 79.88,32.38 81.28,32.38 77.47,31.88 73.66,31.75 49.53,19.05 46.99,22.86 55.88,16.51 34.29,31.75 98.74,66.04 92.68,5.08 39.37,24.13 31.75,19.05 43.18,22.86 69.85,3.81 77.47,24.13 68.58,29.21 54.61,21.59 91.44,19.05 69.85,21.59 34.29,25.4 45.72,16.51 37.47,40.01 113.03,51.82 113.03,37.34 108.71,56.13 113.03,22.61 116.97,51.56 109.6,66.04 107.06,53.09 114.43,48.77 105.54,37.34 100.71,37.59 114.43,34.29 108.08,34.04 116.71,15.24 114.3,19.05 114.43,66.29 116.71,32 107.95,18.92 100.33,19.05 105.41,13.84 106.17,13.84 113.03,7.87 96.11,11.1 90.68,13.46 91.44,13.46 98.85,10.89 100.25,12.09 100.25,10.89 53.34,60.32 83.82,2.54 88.9,2.54 93.98,2.54 99.06,2.54 100.33,7.62 91.44,24.13 110.49,2.54 114.3,2.54
  pour Top (no thermals): 17.27,26.29 17.53,26.54 17.53,28.57 17.27,28.83 15.75,28.83 15.49,28.57 15.49,26.54 15.75,26.29
  pour Route15 (rank 5): 27.94,1.27 1.27,1.27 1.27,67.31 30.48,67.31 30.48,21.59 27.94,21.59
  pour Top: 23.37,24.51 23.37,25.53 23.11,25.78 20.32,25.78 20.07,25.53 20.07,24.51 20.32,24.26 23.11,24.26
  pour Bottom (rank 4, no thermals): 26.67,30.48 26.67,41.91 30.48,41.91 30.48,67.31 1.27,67.31 1.27,30.48
  pour Top: 12.32,24.26 12.57,24.51 12.57,25.53 12.32,25.78 9.65,25.78 9.4,25.53 9.4,24.51 9.65,24.26
  pour Top (rank 2, no thermals): 25.78,33.78 24.51,33.78 24.26,34.04 24.51,36.2 26.29,36.2 26.03,34.04
  pour Top (rank 2, no thermals): 28.58,44.32 28.58,43.05 28.32,42.8 26.54,42.8 26.54,44.58 28.32,44.58
  pour Top (rank 4, no thermals): 26.67,30.48 26.67,41.91 30.48,41.91 30.48,67.31 1.27,67.31 1.27,30.48
  pour Route2 (rank 4, no thermals): 26.67,30.48 26.67,41.91 30.48,41.91 30.48,67.31 1.27,67.31 1.27,30.48
  pour Route2 (rank 4): 31.11,68.58 31.11,41.27 27.31,41.27 27.31,29.84 24.77,29.84 24.77,23.49 10.29,23.49 10.29,5.71 9.4,5.71 9.4,24.13 24.13,24.13 24.13,30.48 26.67,30.48 26.67,41.91 30.48,41.91 30.48,68.58 1.27,68.58 arc90 0,67.31 0,1.27 arc90 1.27,0 129.54,0 arc90 130.81,1.27 130.81,67.31 arc90 129.54,68.58
  pour Bottom (rank 4): 130.81,67.31 arc90 129.54,68.58 31.11,68.58 31.11,41.27 27.31,41.27 27.31,29.84 24.77,29.84 24.77,23.49 10.29,23.49 10.29,5.71 9.4,5.71 9.4,24.13 24.13,24.13 24.13,30.48 26.67,30.48 26.67,41.91 30.48,41.91 30.48,68.58 1.27,68.58 arc90 0,67.31 0,1.27 arc90 1.27,0 129.54,0 arc90 130.81,1.27
  pour Bottom (no thermals): 1.27,5.08 1.27,1.27 6.35,1.27 6.35,5.08
  pour Route15 (no thermals): 1.27,5.08 1.27,1.27 6.35,1.27 6.35,5.08
  pour Route2 (no thermals): 1.27,5.08 1.27,1.27 6.35,1.27 6.35,5.08
  pour Top (no thermals): 1.27,5.08 1.27,1.27 6.35,1.27 6.35,5.08
  pour Top (rank 4): 130.81,67.31 arc90 129.54,68.58 31.11,68.58 31.11,41.27 27.31,41.27 27.31,29.84 24.77,29.84 24.77,23.49 10.29,23.49 10.29,5.71 9.4,5.71 9.4,24.13 24.13,24.13 24.13,30.48 26.67,30.48 26.67,41.91 30.48,41.91 30.48,68.58 1.27,68.58 arc90 0,67.31 0,1.27 arc90 1.27,0 129.54,0 arc90 130.81,1.27
  pour Route15 (rank 4): 130.81,67.31 arc90 129.54,68.58 31.11,68.58 31.11,41.27 27.31,41.27 27.31,29.84 24.77,29.84 24.77,23.49 10.29,23.49 10.29,5.71 9.4,5.71 9.4,24.13 24.13,24.13 24.13,30.48 26.67,30.48 26.67,41.91 30.48,41.91 30.48,68.58 1.27,68.58 arc90 0,67.31 0,1.27 arc90 1.27,0 129.54,0 arc90 130.81,1.27
  pour Bottom (no thermals): 100.65,51.84 97.75,51.84 97.75,53.44 98.35,54.04 100.65,54.04
  pour Bottom (no thermals): 100.65,40.54 97.75,40.54 97.75,42.14 98.35,42.74 100.65,42.74
  pour Bottom (no thermals): 100.65,29.24 97.75,29.24 97.75,30.84 98.35,31.44 100.65,31.44
  pour Bottom (no thermals): 100.65,10.37 97.75,10.37 97.75,11.97 98.35,12.57 100.65,12.57
GPIO_0
  Bottom 0.203: JP3.1 63.5,5.08 U1.8
GPIO_1
  Bottom 0.203: JP3.2 70.3,5.08 69.18,6.2 64.92,6.2 U1.9
GPIO_2
  Bottom 0.203: JP3.3 71.12,7.62 66.04,7.62 U1.10
GPIO_3
  Top 0.203: JP2.2 71.12,10.16 66.04,15.24 63.5,15.24 U1.11
GPIO_4
  Top 0.203: JP2.3 68.58,10.16 U1.12
I2C_SCL  (via drill 0.35)
  Top 0.152: U1.19/A5 50.67,30.35 57.91,30.35 58.42,29.84 58.42,28.57 59.77,27.23 60.49,26.51 60.49,25.6 61.47,24.63 R4.2 62.19,24.45 63.5,25.76 v63.5,27.94 | U$8.P$4 75.8,30.07 75.69,29.97 75.69,29.21 73.15,26.67 v69.85,26.67 71.12,25.4 80.01,25.4 82.55,22.86 JP7.2
  Bottom 0.152: v69.85,26.67 68.58,27.94 v63.5,27.94
I2C_SDA  (via drill 0.35)
  Top 0.152: U1.18/A4 53.34,27.94 57.15,27.94 57.95,27.14 57.95,25.6 58.93,24.63 R3.2 60.96,22.42 v60.96,20.32 | U$8.P$5 75.86,30.57 75.39,30.1 75.39,29.54 73.07,27.23 69.62,27.23 69.06,26.67 v68.58,26.67 70.36,24.89 79.76,24.89 83.82,20.83 86.36,20.83 87.63,22.1 JP7.1
  Bottom 0.152: v68.58,26.67 68.58,21.59 67.31,20.32 v60.96,20.32
INPN1
  Top 0.203: U7.INPN 103.18,51.96 R12.2 R13.1
INPN2
  Top 0.203: U12.INPN 103.18,40.66 R14.2 R15.1
INPN3
  Top 0.203: U13.INPN 103.18,29.37 R28.2 R29.1
INPN4
  Top 0.203: R37.1 R36.2 101.53,10.39 U17.INPN
INPUT1
  Top 0.152: U7.INPP 101.56,50.04 TP1.TP 107.95,53.34 108.97,54.36 111.51,54.36 111.89,54.74 U16.6 111.89,57.79 113.16,59.05 113.16,59.94 | 113.16,59.94 U16.2 113.16,63.37 112.78,63.75 111.51,63.75 111.39,63.63 111.37,63.63 111.15,63.41 111.15,60.05 111.51,59.69 112.9,59.69 113.16,59.94
INPUT2
  Top 0.152: U12.INPP 102.2,38.1 TP2.TP 107.95,38.86 108.97,39.88 111.76,39.88 111.89,40.01 U15.6 111.89,43.56 113.16,44.83 U15.2
INPUT3
  Top 0.152: U13.INPP 102.08,26.92 105.16,26.92 TP3.TP 105.92,26.42 107.19,25.15 111.76,25.15 111.89,25.27 U14.6 111.89,29.08 113.16,30.35 113.16,31.24 | 113.16,31.24 U14.2 113.16,34.16 112.78,34.54 111.51,34.54 111.39,34.42 111.37,34.42 111.23,34.29 111.23,33.1 111.25,33.08 111.25,30.99 111.51,30.73 112.65,30.73 113.16,31.24
INPUT4
  Top 0.152: U19.2 113.16,19.43 112.78,19.81 111.51,19.81 111.25,19.56 111.25,16.26 111.51,16 112.65,16 113.16,16.51 113.16,15.62 111.89,14.35 U19.6 111.89,10.54 111.76,10.41 109.47,10.41 107.95,8.89 TP11.TP | U17.INPP 101.13,9.02 107.44,9.02 TP11.TP | TP11.TP 107.82,8.51 107.32,9.02
N$1
  Top 0.254: U9.P$4 8.57,48.74 R21.1 R20.2
N$2
  pour Top (no thermals): 17.4,33.15 17.4,36.7 18.03,36.7 18.03,38.23 19.94,38.23 19.94,36.07 23.11,36.07 23.37,35.81 23.37,33.15 23.11,32.89 17.65,32.89
N$3
  Top 0.254: U8.P$1 19.03,39.51 R25.2 19.38,39.66 C28.2 R24.1
N$4
  pour Top (no thermals): 10.16,35.31 13.72,35.31 15.11,36.7 15.62,36.7 15.62,33.15 15.37,32.89 9.78,32.89 9.4,32.51 9.4,31.5 9.14,31.24 6.98,31.24 6.73,31.5 6.73,33.65 6.98,33.91 9.02,33.91 10.16,35.05
N$5
  pour Top (no thermals): 5.59,38.35 5.59,35.69 7.24,35.69 7.24,34.54 8.76,34.54 9.91,35.69 12.7,35.69 13.46,36.45 13.46,37.46 11.05,37.46 11.05,38.35
N$6
  Top 0.254: U8.P$4 16.01,40.67 R27.1 16.57,41.93 16.67,41.93 16.83,42.09 16.83,43.33 16,44.16 R26.2 C32.1
N$7
  Top 0.203: U$7.20 U$7.21
N$8
  Top 0.152: R41.1 114.59,20.66 117.86,17.53 117.86,8.89 | 117.86,8.89 H4.TP | J4.1 119.13,7.62 117.86,8.89
N$9
  Top 0.254: U$8.P$2 79.26,29.07 25MHZ1.P$4
N$10
  Top 0.254: 25MHZ1.P$2 81.03,30.45 81.03,29.84 80.76,29.57 U$8.P$3
N$11
  Top 0.406: R31.2 LED2.C
N$12
  Top 0.203: D4.2 44.01,51.24 45.09,50.16 45.09,48.26 46.03,47.31 C11.1 R17.2 45.66,44.2 40.39,44.2 38.61,42.42 U6.5 36.98,41.5 36.32,42.16 R18.2
N$13
  Top 0.203: U6.2 41.15,45.59 41.59,45.15 R16.1 43.64,46.08 D4.1
N$14
  Top 0.203: U6.1 42.42,48.51 41.45,49.49 D4.3
N$15
  Top 0.203: R19.2 35.69,46.8 35.69,48.36 U11.1
N$16
  Top 0.203: R18.1 36.79,45.87 U11.3
N$17
  Top 0.406: LED1.C R30.2
N$18
  Top 0.152: R32.1 116.75,35.39 117.86,34.29 117.86,26.67 | 117.86,26.67 H3.TP | J3.1 119.13,25.4 117.86,26.67
N$19
  Top 0.152: U14.3 111.89,33.57 R32.2
N$20
  Top 0.152: R33.1 116.5,49.87 117.86,48.51 117.86,44.45 | 117.86,44.45 H2.TP | J2.1 119.13,43.18 117.86,44.45
N$21
  Top 0.152: R33.2 111.89,48.04 U15.3
N$22
  Top 0.152: U16.3 111.89,62.78 R34.2
N$23
  Top 0.152: 117.86,62.23 117.86,63.25 116.5,64.6 R34.1 | 117.86,62.23 H1.TP | J1.1 119.13,60.96 117.86,62.23
N$24
  Top 0.203: R2A1.2 81.6,65.41 U$6.11
N$25
  Top 0.203: U$6.9 U$6.8
N$26
  Top 0.203: U$6.12 R1A1.2 84.77,64.78 R2A1.1 R3A1.1
N$27
  Top 0.203: U$6.14 69.21,65.41 67.95,64.13 R2D1.2
N$28
  Top 0.203: R1D1.2 65.09,65.41 | 65.09,65.41 R2D1.1 R3D1.1 | 65.09,65.41 67.95,65.41 69.21,66.68 U$6.13
N$29
  Top 0.203: U$6.16 U$6.17
N$30
  Top 0.203: R2C1.1 67.95,55.24 69.21,53.98 U$6.23
N$31
  Top 0.203: U$6.24 69.21,52.7 67.95,53.98 66.36,53.98 65.25,52.86 | 65.25,52.86 R1C1.1 | 65.25,52.86 65.09,53.02 R2C1.2 R3C1.2
N$32
  Top 0.203: R2C2.1 67.95,37.46 69.21,36.2 U$7.23
N$33
  Top 0.203: U$6.2 81.6,53.98 R2B1.2
N$34
  Top 0.203: U$6.1 R1B1.2 82.87,53.34 R2B1.1 R3B1.1
N$35
  Top 0.203: U$6.5 U$6.4
N$36
  Top 0.203: U$6.21 U$6.20 U$6.21
N$37  (via drill 0.35)
  Bottom 0.203: RCLK1.1 69.02,60.32 v70.33,60.32
N$38
  Top 0.203: R2A2.2 81.6,47.62 U$7.11
N$39
  Top 0.203: U$7.9 U$7.8
N$40
  Top 0.203: U$7.12 R1A2.2 84.77,46.99 R2A2.1 R3A2.1
N$41
  Top 0.203: U$7.14 69.09,47.62 67.82,46.35 R2D2.2
N$42
  Top 0.203: R3D2.1 R2D2.1 65.09,47.62 | R1D2.2 65.09,47.62 | U$7.13 69.21,48.9 67.95,47.62 65.09,47.62
N$43
  Top 0.203: U$7.16 U$7.17
N$44
  Top 0.203: U$7.24 69.21,34.93 69.21,34.98 68,36.2 66.36,36.2 65.25,35.08 | 65.25,35.08 R1C2.1 | 65.25,35.08 65.09,35.24 R2C2.2 R3C2.2
N$45
  Top 0.152: R41.2 112.01,17.3 U19.3
N$46
  Top 0.203: U$7.2 81.6,36.2 R2B2.2
N$47
  Top 0.203: U$7.1 R1B2.2 82.87,35.57 R2B2.1 R3B2.1
N$48
  Top 0.203: U$7.5 U$7.4
N$50  (via drill 0.35)
  Bottom 0.203: RCLK2.1 67.95,41.91 68.64,42.61 70.27,42.61 v70.33,42.54
OUT_2ND_A1
  Top 0.203: R3A1.2 82.87,61.91 80.64,64.13 U$6.10 78.11,64.13 74.93,67.31 67.63,67.31 R1D1.1
OUT_2ND_A2
  Top 0.203: R3A2.2 82.87,44.13 80.64,46.35 U$7.10 78.11,46.35 74.93,49.53 67.06,49.53 R1D2.1
OUT_2ND_B2
  Top 0.203: R3B2.2 82.87,39.69 80.64,37.46 U$7.3 78.11,37.46 74.93,34.29 66.99,34.29 R1C2.2
OUT_2ND_ORDER_B1
  Top 0.203: R3B1.2 82.87,57.47 80.64,55.24 U$6.3 78.11,55.24 74.93,52.07 66.99,52.07 R1C1.2
PEAK_CLEAR
  Top 0.203: U1.23/A9 39.37,34.9 34.29,39.98 R19.1
PEAK_OUT
  Top 0.203: R17.1 R16.2 44.38,43.05 41.78,43.05 41.15,42.42 U6.7 U6.6 TP10.TP 40.13,38.61 41.91,36.83 U1.22/A8
SIG_OUT_0
  Top 0.152: U2.10 41.02,58.77 43.76,61.52 47.55,61.52 JP9.7
  Top 0.203: U2.11 U2.10
SIG_OUT_1
  Top 0.152: U2.15 37.82,55.52 37.47,55.88 37.47,59.44 39.37,61.34 42.29,61.34 JP9.5
  Top 0.203: U2.15 U2.16
SIG_OUT_2
  Top 0.152: U2.1 46.11,54.23 45.21,53.34 40.13,53.34 | 39.62,53.34 38.1,53.34 38.1,54.45 36.91,55.65 36.91,58.76 33.33,62.34 33.33,64.66 33.89,65.23 37.64,65.23 JP9.3 | 39.62,53.34 39.88,53.34 | 39.88,53.34 40.13,53.34 | U6.3 39.88,49.29 39.9,49.31 39.9,49.75 39.88,49.77 39.88,53.09 | 39.88,53.09 39.88,53.34 | 40.13,53.34 39.88,53.09 | 39.62,53.34 39.88,53.09
  Top 0.203: U2.2 U2.1
SIG_OUT_3
  Top 0.152: U2.6 44.59,58.12 40.94,54.47 38.48,54.47 37.19,55.76 37.19,60.6 JP9.1
  Top 0.203: U2.7 U2.6
SS3  (via drill 0.26, 0.35)
  Top 0.203: U8.P$7 16.01,35.95 v15.88,35.81 | v14.1,27.18 14.01,27.09 R22.1 10.75,27.09 C26.1
  Route15 0.203: v15.88,35.81 15.88,28.57 14.48,27.18 v14.1,27.18
SS4  (via drill 0.26, 0.35)
  Top 0.203: U8.P$9 17.01,35.95 v17.14,35.81 | v18.67,27.05 20.28,27.05 R23.1 22.27,27.09 C27.1
  Route15 0.203: v17.14,35.81 17.14,28.57 v18.67,27.05
UART1_RXD
  Top 0.152: JP8.2 U1.0
UART1_TXD
  Top 0.152: JP8.1 U1.1
V+
  Top 0.254: U8.P$8 C25.1
  Top 1.27: CON4.1 3.81,27.94 5.08,29.21 10.69,29.21 L2.P$1 | U1.VIN 29.89,31.07 L1.P$1
  pour Top (no thermals): 23.5,28.45 23.5,32.26 23.24,32.51 10.03,32.51 9.78,32.26 9.78,28.45 10.03,28.19 13.97,28.19 14.86,29.21 18.16,29.21 19.05,28.19 23.24,28.19
  pour Top: 17.02,32.77 17.02,34.8 16.64,35.18 16.38,35.18 16,34.8 16,32.77 15.62,32.38 15.62,29.46 17.27,29.46 17.4,29.59 17.4,32.38
VGA_INPUT1
  Top 0.2: U7.VGAI U7.PRAO
  Top 0.203: R12.1 102.93,53.91 U7.PRAO
VGA_INPUT2
  Top 0.2: U12.VGAI U12.PRAO
  Top 0.203: R14.1 102.93,42.62 U12.PRAO
VGA_INPUT3
  Top 0.2: U13.VGAI U13.PRAO
  Top 0.203: R28.1 102.93,31.32 U13.PRAO
VGA_INPUT4
  Top 0.2: U17.PRAO U17.VGAI
  Top 0.203: R36.1 103.2,12.09 102.85,12.45 101.43,12.45 U17.PRAO
VNEG1
  Top 0.305: C21.1 99.88,55.43 U7.VNEG
  Top 1.016: C21.1 101.48,55.55 L4.1
VNEG2
  Top 0.305: C40.1 99.88,44.13 U12.VNEG
  Top 1.016: C40.1 101.48,44.25 L7.1
VNEG3
  Top 0.305: C46.1 99.88,32.83 U13.VNEG
  Top 1.016: C46.1 101.48,32.95 L11.1
VNEG4
  Top 0.305: 99.88,14.04 U17.VNEG | 99.88,14.04 99.87,14.05 | C62.1 100.67,14.84 99.88,14.04
  Top 1.016: C62.1 101.48,14.09 L6.1
VPOS1
  Top 0.305: C36.1 96.66,53.91 U7.VPOS
  Top 1.016: L5.1 94.24,54.48 C36.1
VPOS2
  Top 0.305: C42.1 96.66,42.62 U12.VPOS
  Top 1.016: L8.1 94.11,43.18 C42.1
VPOS3
  Top 0.305: C48.1 96.66,31.32 U13.VPOS
  Top 1.016: L12.1 94.37,31.88 C48.1
VPOS4
  Top 0.305: U17.VPOS 96.66,12.46 C64.1
  Top 1.016: C64.1 94.27,13.02 L9.1
VREF
  Top 0.254: U8.P$3 U8.P$2 17.01,40.67 R27.2 17.69,41.35 C31.1

## Text on the board
tPlace: +5V | HYDROPHONE SIGNAL / PROCESSOR V5 / Rev. 1: 05/2020 | CREDIT: / NICHOLAS K. / MOIRA B. / KOLTIN K.-H. / DAVID L. / ALAIN L. / Andrew S. / Kirill M. | GND / REFS | GND | 5V | SCL | SDA | CLK2 | CLK1 | 12 | 11 | G | RX | TX | -5V
bPlace: 08 | 09 | 10